# Altium schematic sheet Camera_Ribbon.SchDoc: WiFI Camera
size A4; Revision: Rev 3.0; SheetNumber: 1
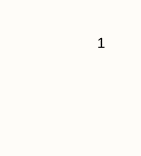
[diagram p0: Camera_Ribbon.SchDoc, top right]
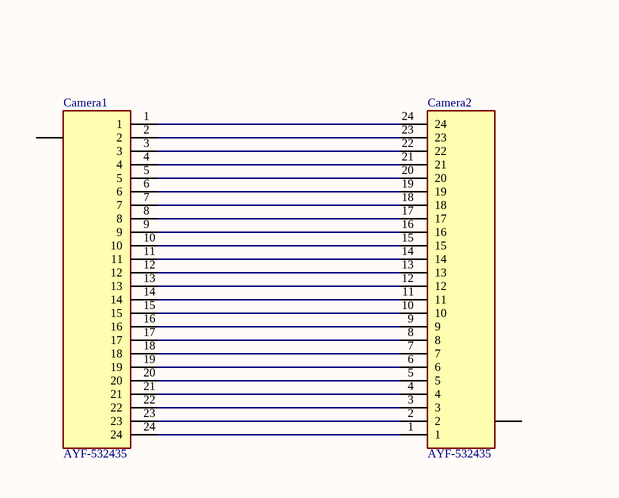
[diagram p1: Camera_Ribbon.SchDoc, bottom left]

## Parts
Camera1  AYF-532435  [FPC-SMD_24P-P0.50_L6.4-W15.1]
Camera2  AYF-532435  [FPC-SMD_24P-P0.50_L6.4-W15.1]

## Nets
NetCamera1_1: Camera1.1 Camera2.24
NetCamera1_2: Camera1.2 Camera2.23
NetCamera1_3: Camera1.3 Camera2.22
NetCamera1_4: Camera1.4 Camera2.21
NetCamera1_5: Camera1.5 Camera2.20
NetCamera1_6: Camera1.6 Camera2.19
NetCamera1_7: Camera1.7 Camera2.18
NetCamera1_8: Camera1.8 Camera2.17
NetCamera1_9: Camera1.9 Camera2.16
NetCamera1_10: Camera1.10 Camera2.15
NetCamera1_11: Camera1.11 Camera2.14
NetCamera1_12: Camera1.12 Camera2.13
NetCamera1_13: Camera1.13 Camera2.12
NetCamera1_14: Camera1.14 Camera2.11
NetCamera1_15: Camera1.15 Camera2.10
NetCamera1_16: Camera1.16 Camera2.9
NetCamera1_17: Camera1.17 Camera2.8
NetCamera1_18: Camera1.18 Camera2.7
NetCamera1_19: Camera1.19 Camera2.6
NetCamera1_20: Camera1.20 Camera2.5
NetCamera1_21: Camera1.21 Camera2.4
NetCamera1_22: Camera1.22 Camera2.3
NetCamera1_23: Camera1.23 Camera2.2
NetCamera1_24: Camera1.24 Camera2.1

Not connected (* = marked no-connect by the designer): Camera1 0; Camera2 0

## Notes on the sheet
- 1
- Title
- Size:
- Date:
- A4
- Number:
- Time:
- Revision:
- Sheet
- of
- File:

## Library data of the parts
Camera1 Camera2 = AYF-532435: Connector; Manufacturer_Name: Panasonic; Datasheet Link: https://www.panasonic-electric-works.com/pew/eu/downloads/ds_y5b_y5bw_en.pdf; Height: 1mm; Manufacturer_Part_Number: AYF-532435